# Altium project PUA.PrjPcb (part 1 of 14)
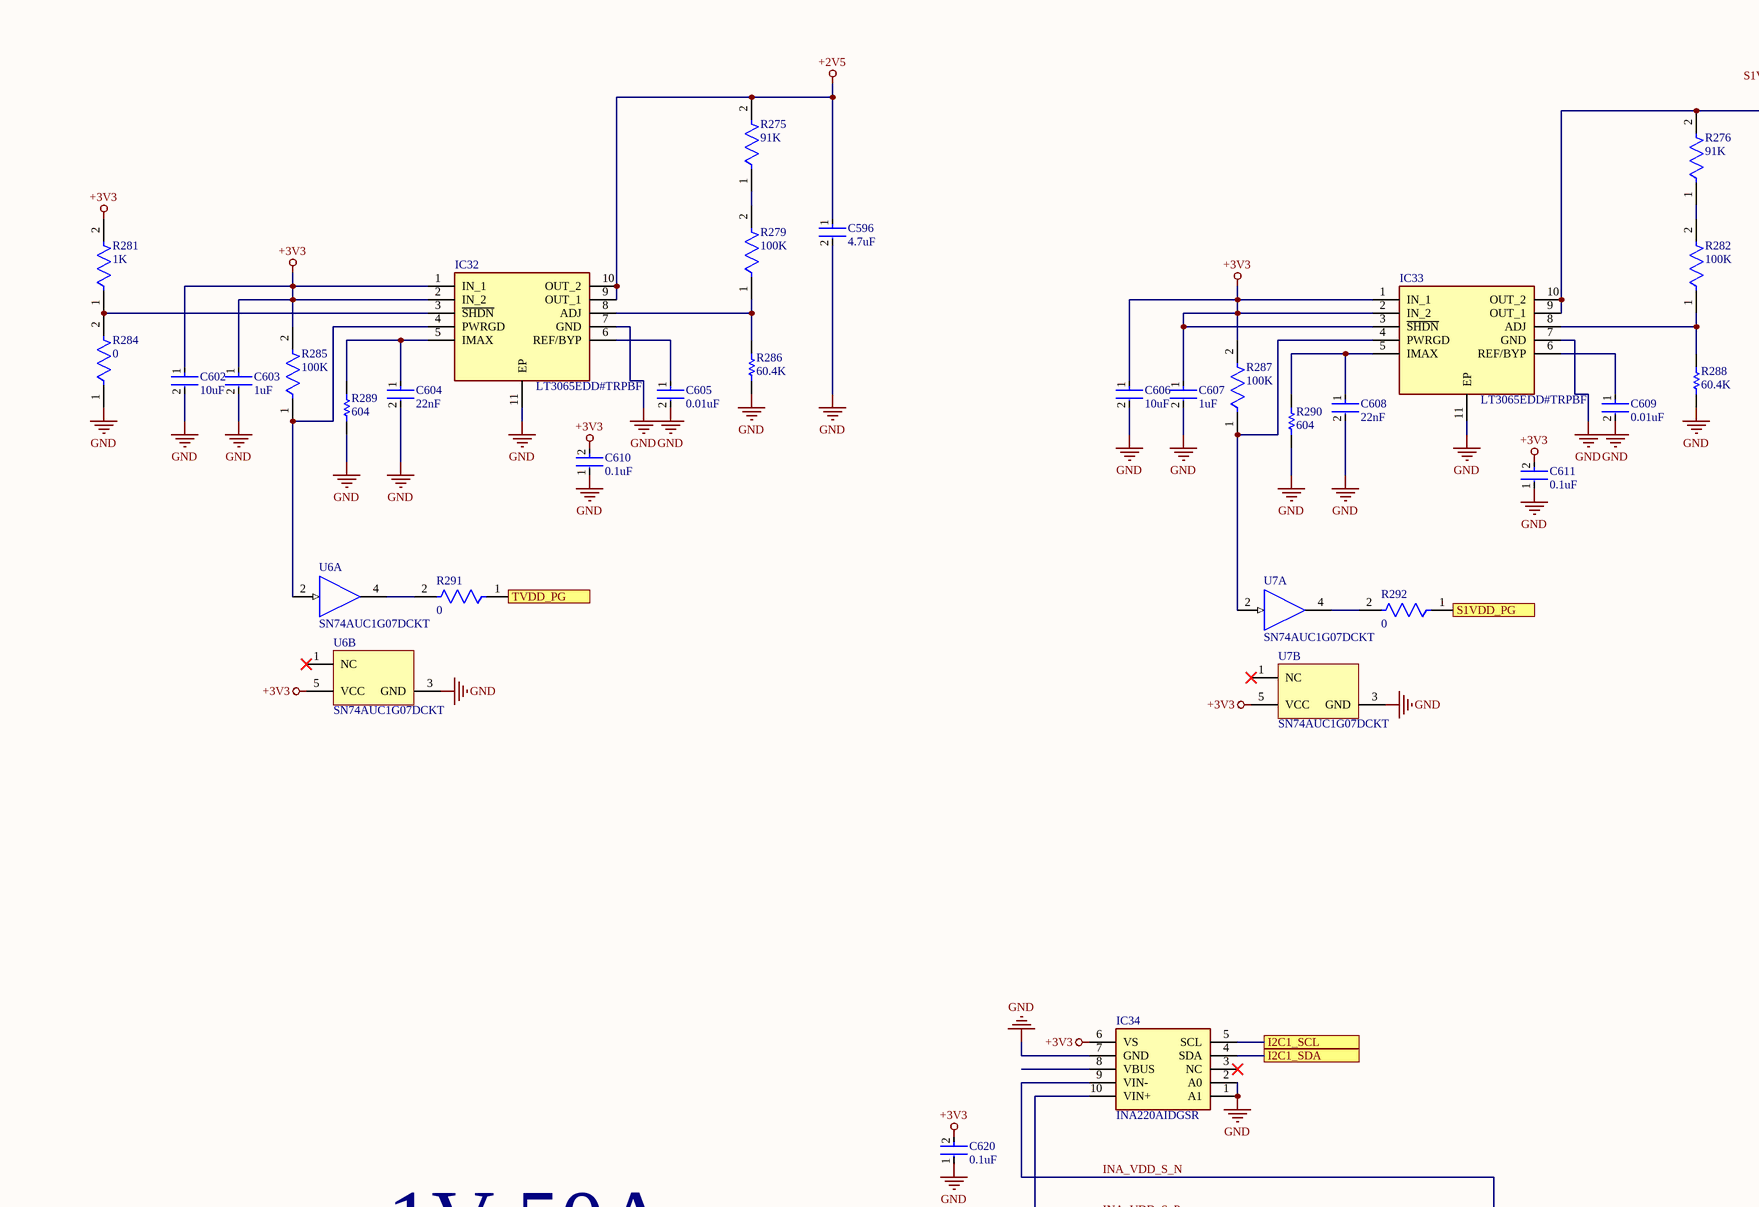
[diagram p0: Main_Power.SchDoc, top left]
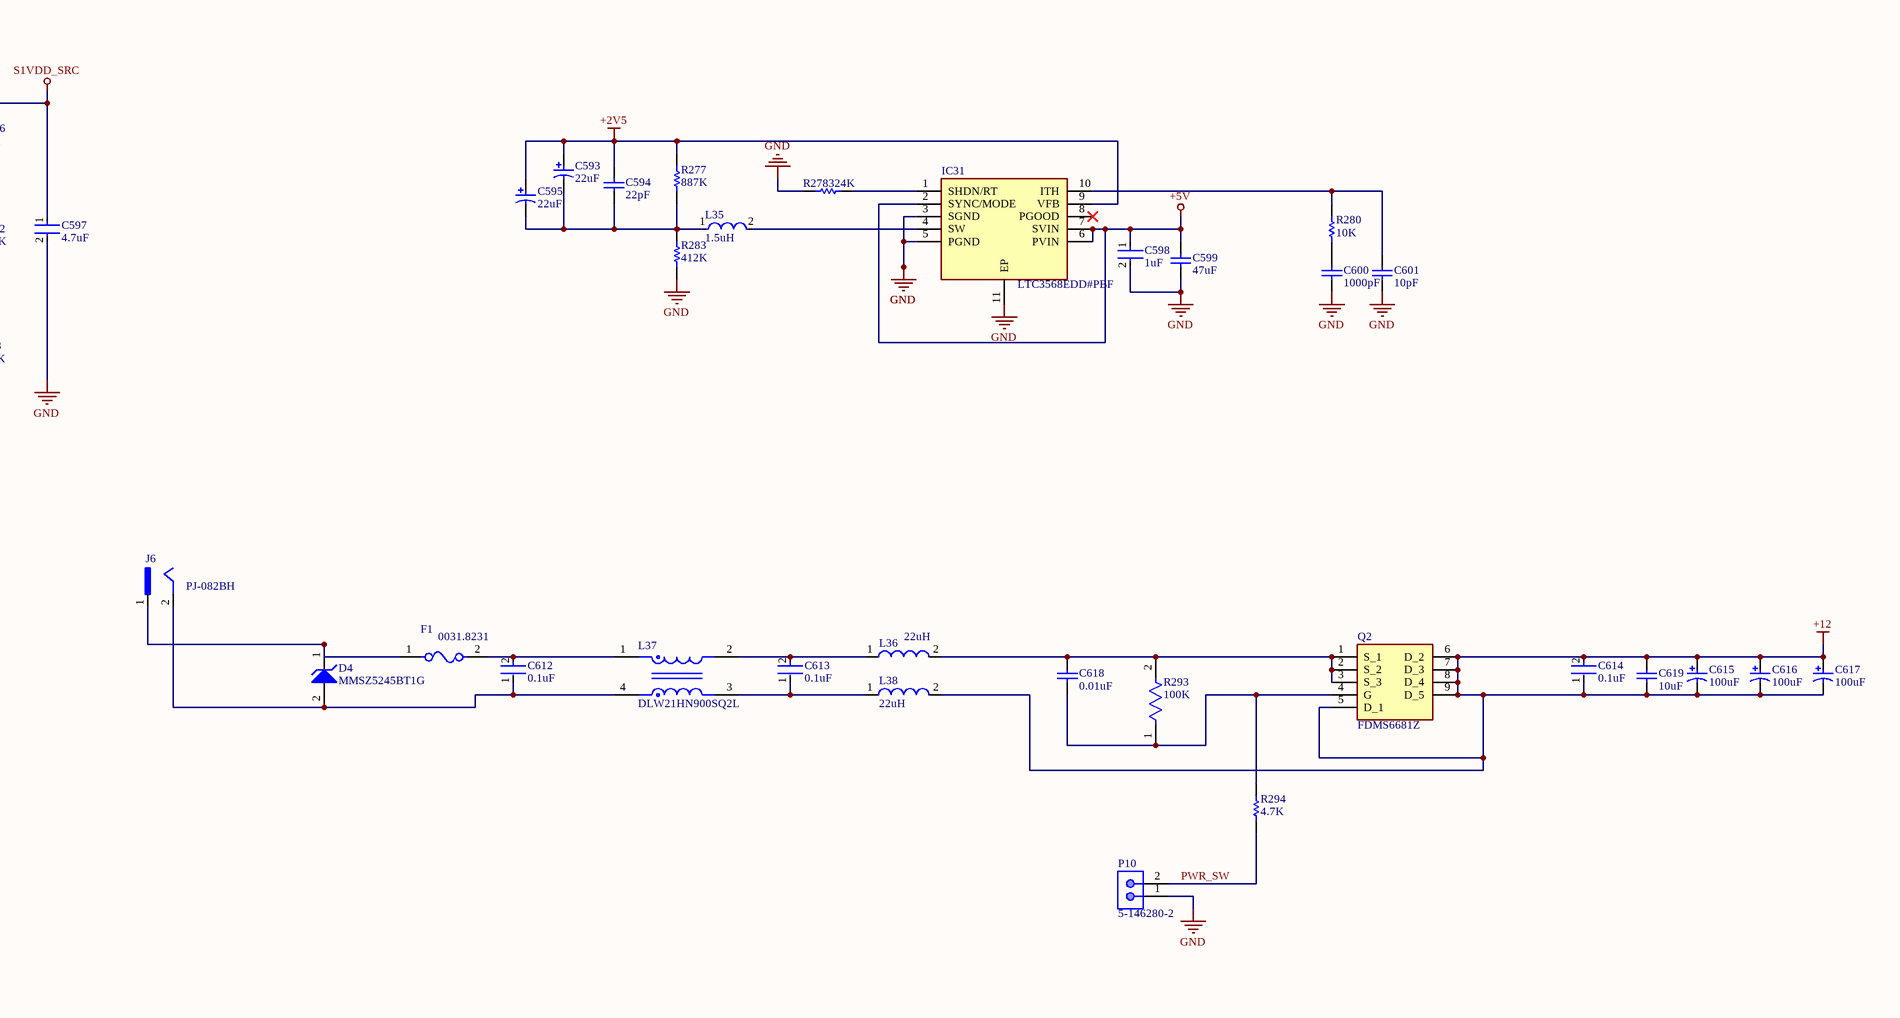
[diagram p1: Main_Power.SchDoc, top right]
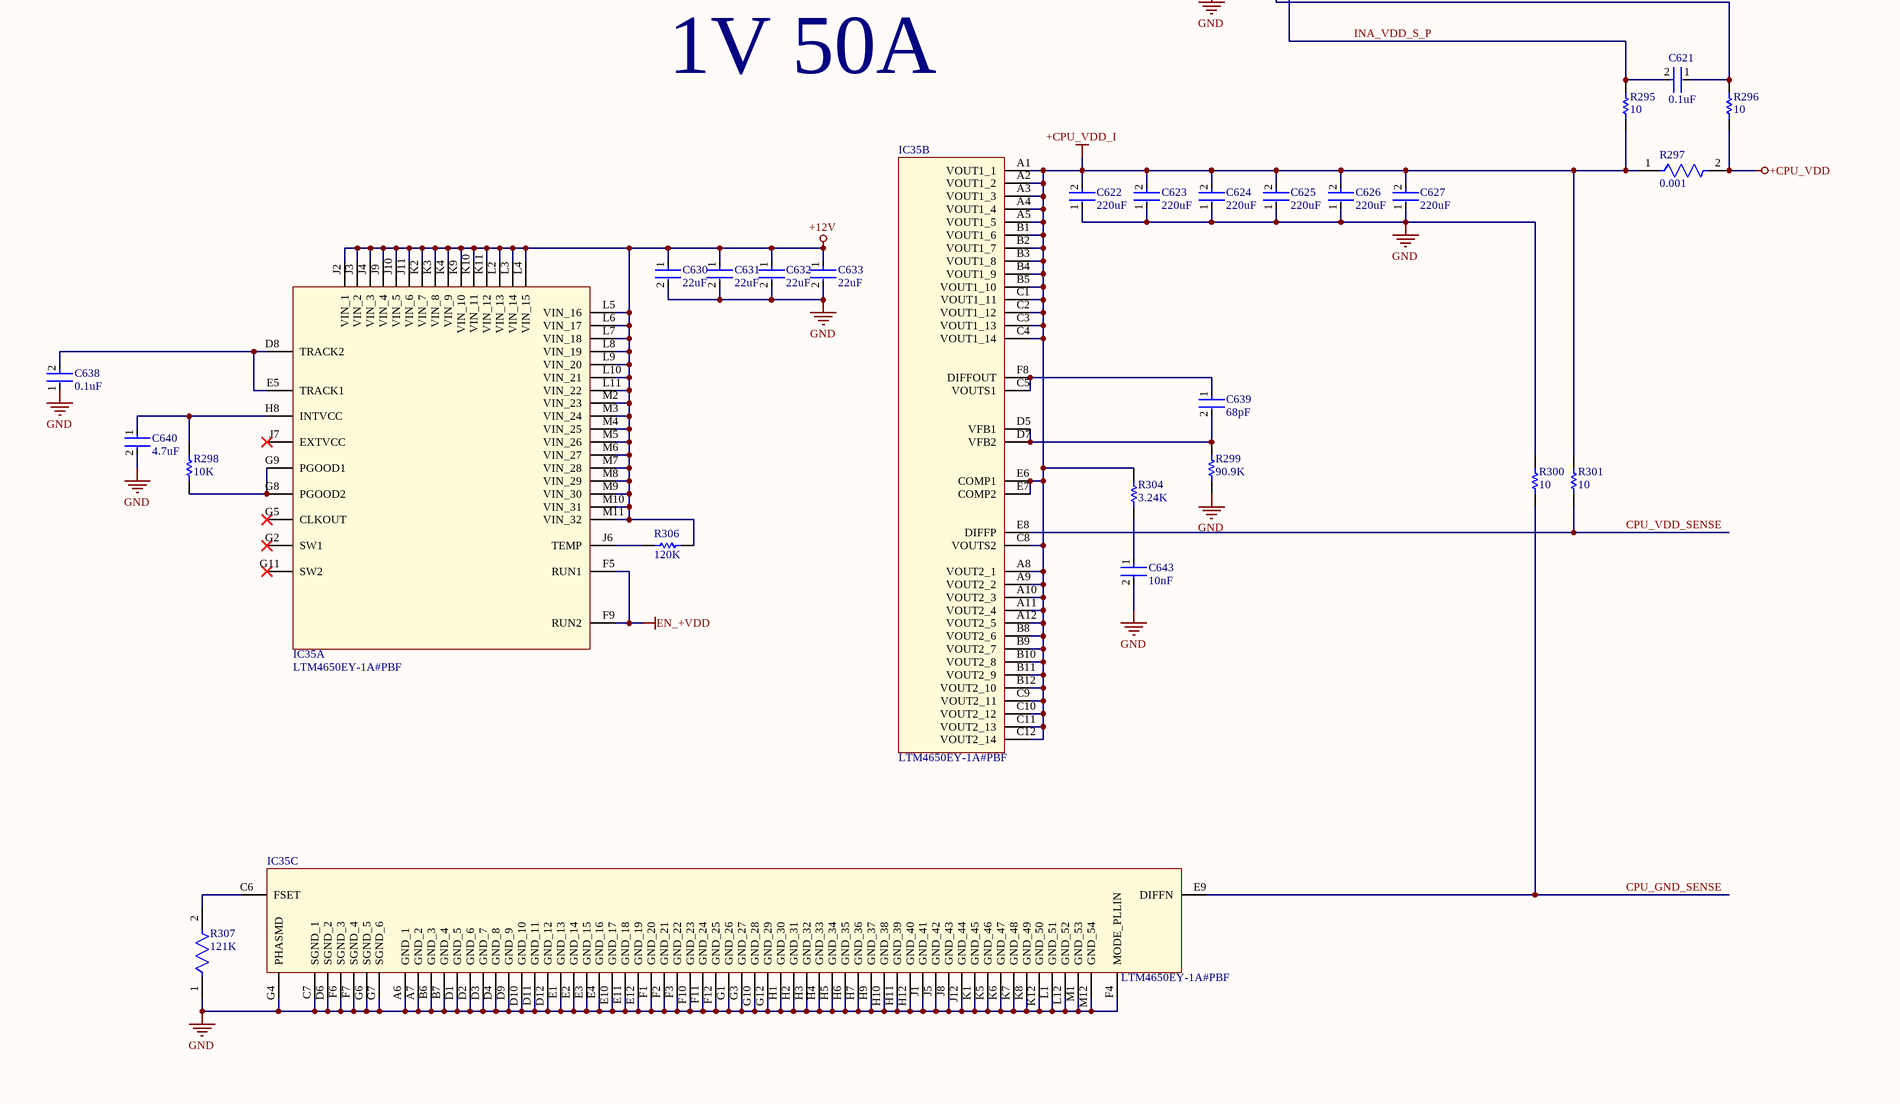
[diagram p2: Main_Power.SchDoc, bottom left]
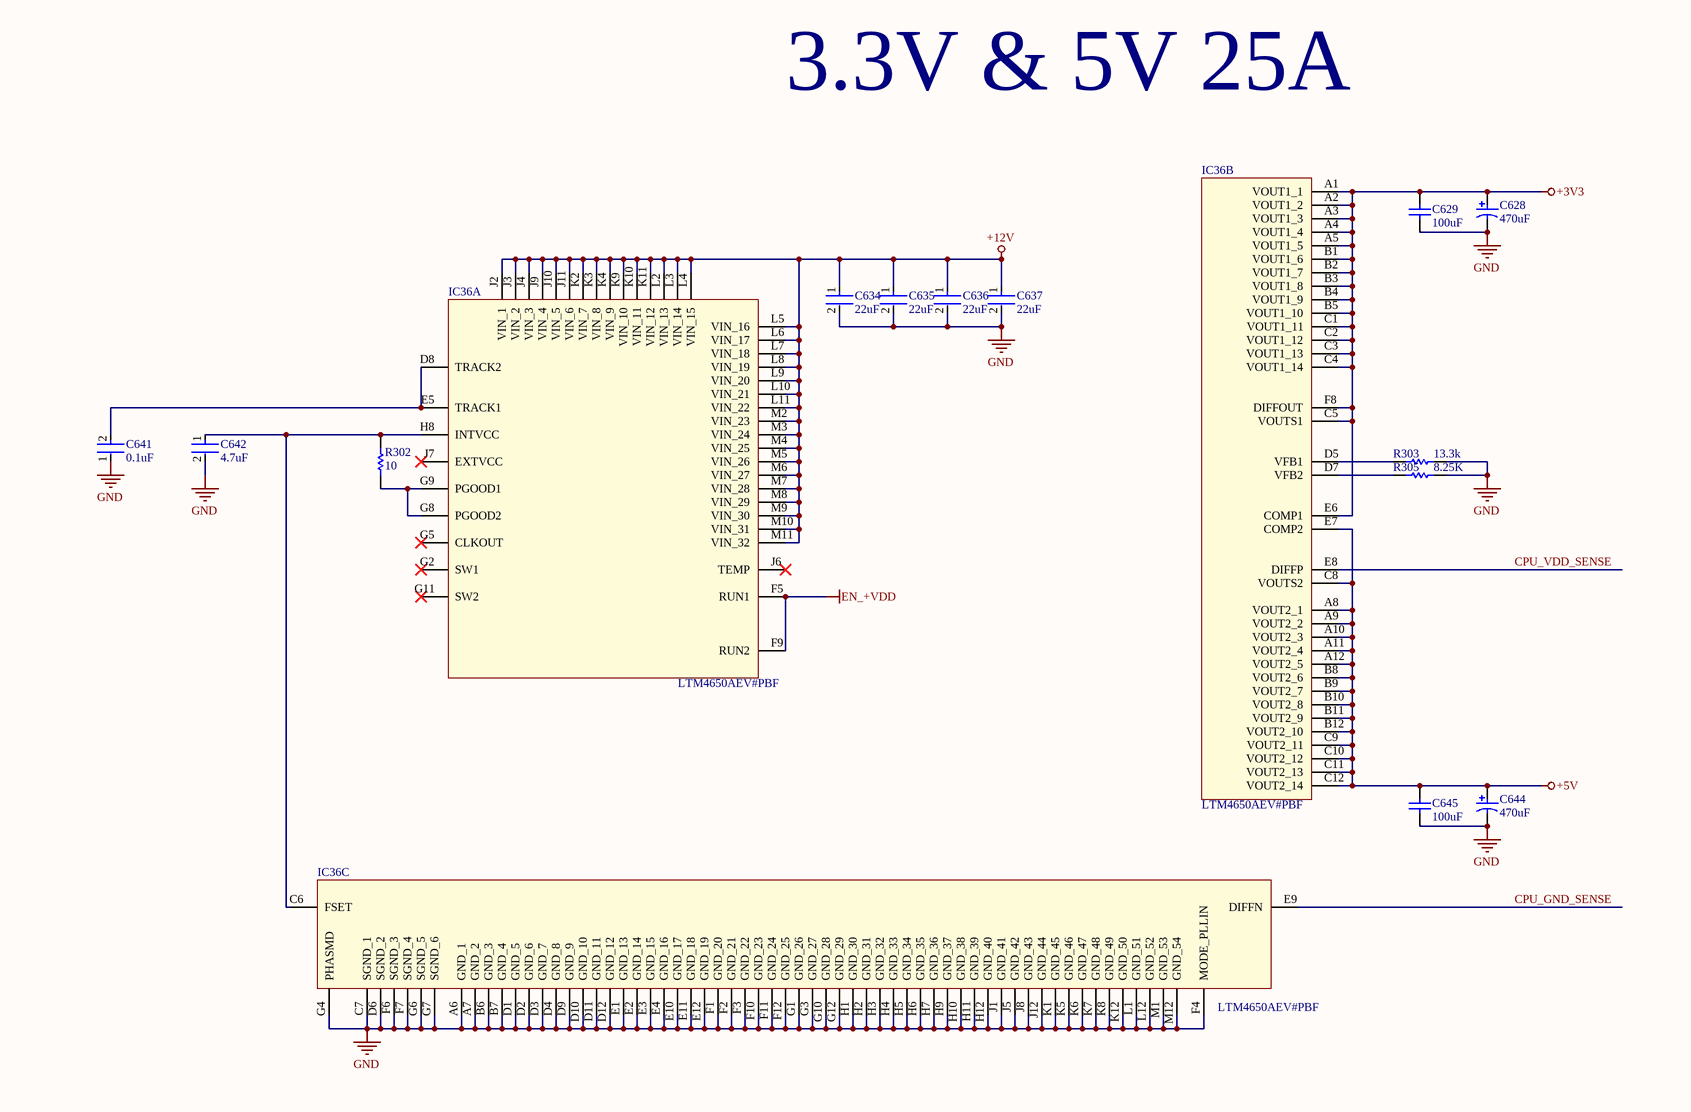
[diagram p3: Main_Power.SchDoc, bottom right]
28 sheets, 2246 parts. Net scope: hierarchical (ports join the sheet entries above them; power ports are global).
Sheets:
  Main_Power.SchDoc
  Public_CPU_Power.SchDoc
  Public_CPU_Reset_IO.SchDoc
  Public_CPU_IO.SchDoc
  Public_CPU_USB.SchDoc
  Public_CPU_DDR4.SchDoc
  Public_CPU_RGMII.SchDoc
  Public_CPU_Sub_Power_Supplies.SchDoc
  Public_QSGMII_ETHERNET.SchDoc
  Public_QSGMII_ETHERNET_POWER.SchDoc
  Private_CPU_Power.SchDoc
  Private_CPU_Reset_IO.SchDoc
  Private_CPU_IO.SchDoc
  Private_CPU_USB.SchDoc
  Private_CPU_DDR4.SchDoc
  Private_CPU_RGMII.SchDoc
  Private_CPU_Sub_Power_Supplies.SchDoc
  Server_CPU_Power.SchDoc
  Server_CPU_Reset_IO.SchDoc
  Server_CPU_IO.SchDoc
  Server_CPU_USB.SchDoc
  Server_CPU_DDR4.SchDoc
  Server_CPU_RGMII.SchDoc
  Server_CPU_Sub_Power_Supplies.SchDoc
  SGMII_CONNECTION.SchDoc
    U_Public_CPU_SerDes = Public_CPU_SerDes.SchDoc
    U_Private_CPU_SerDes = Private_CPU_SerDes.SchDoc
    U_Server_CPU_SerDes = Server_CPU_SerDes.SchDoc

## Sheet Main_Power.SchDoc
size D

### Parts
C593  22uF  [AVX-TAJ-B-2_M]
C594  22pF  [CAPC1005X55X25ML05T10]
C595  22uF  [AVX-TAJ-B-2_M]
C596  4.7uF  [FP-GRM155-0_1-IPC_B]
C597  4.7uF  [FP-GRM155-0_1-IPC_B]
C598  1uF  [FP-GRM15-0_1-MFG]
C599  47uF  [CAPC1206(3216)190_N]
C600  1000pF  [CAPC1005X55X25ML5T10]
C601  10pF  [CAPC1005X55X25ML05T10]
C602  10uF  [FP-C0805C-DG-MFG]
C603  1uF  [FP-GRM15-0_1-MFG]
C604  22nF  [FP-CL288-IPC_C]
C605  0.01uF  [FP-C0402-BB-MFG]
C606  10uF  [FP-C0805C-DG-MFG]
C607  1uF  [FP-GRM15-0_1-MFG]
C608  22nF  [FP-CL288-IPC_C]
C609  0.01uF  [FP-C0402-BB-MFG]
C610  0.1uF  [FP-GRM15-MFG]
C611  0.1uF  [FP-GRM15-MFG]
C612  0.1uF  [FP-GRM15-MFG]
C613  0.1uF  [FP-GRM15-MFG]
C614  0.1uF  [FP-GRM15-MFG]
C615  100uF  [PNSC-FK-V-D8_V]
C616  100uF  [PNSC-FK-V-D8_V]
C617  100uF  [PNSC-FK-V-D8_V]
C618  0.01uF  [CAPC1005X56X25LL10T15]
C619  10uF  [CAPC1210(3225)190_N]
C620  0.1uF  [FP-GRM15-MFG]
C621  0.1uF  [FP-GRM15-MFG]
C622  220uF  [FP-GRM31C-0_3-e0_3_0_9-IPC_C]
C623  220uF  [FP-GRM31C-0_3-e0_3_0_9-IPC_C]
C624  220uF  [FP-GRM31C-0_3-e0_3_0_9-IPC_C]
C625  220uF  [FP-GRM31C-0_3-e0_3_0_9-IPC_C]
C626  220uF  [FP-GRM31C-0_3-e0_3_0_9-IPC_C]
C627  220uF  [FP-GRM31C-0_3-e0_3_0_9-IPC_C]
C628  470uF  [KEMT-T495-X_L]
C629  100uF  [CAPC3225X280X50LL20T25]
C630  22uF  [FP-GRM32-MFG]
C631  22uF  [FP-GRM32-MFG]
C632  22uF  [FP-GRM32-MFG]
C633  22uF  [FP-GRM32-MFG]
C634  22uF  [FP-GRM32-MFG]
C635  22uF  [FP-GRM32-MFG]
C636  22uF  [FP-GRM32-MFG]
C637  22uF  [FP-GRM32-MFG]
C638  0.1uF  [FP-GRM15-MFG]
C639  68pF  [FP-C0805C-DN-MFG]
C640  4.7uF  [FP-GRM155-0_1-IPC_B]
C641  0.1uF  [FP-GRM15-MFG]
C642  4.7uF  [FP-GRM155-0_1-IPC_B]
C643  10nF  [FP-CC0603-DA-MFG]
C644  470uF  [KEMT-T495-X_L]
C645  100uF  [CAPC3225X280X50LL20T25]
D4  MMSZ5245BT1G  [ONSC-SOD-123-2-425-04_V]
F1  0031.8231  [FP-0031_8231-MFG]
IC31  LTC3568EDD#PBF  [SON50P300X300X80-11N-D]
IC32  LT3065EDD#TRPBF  [SON50P300X300X80-11N-D]
IC33  LT3065EDD#TRPBF  [SON50P300X300X80-11N-D]
IC34  INA220AIDGSR  [SOP50P490X110-10N]
IC35  LTM4650EY-1A#PBF  [BGA144C127P12X12_1600X1600X521]  (parts A,B,C of 3)
IC36  LTM4650AEV#PBF  [BGA144C127P12X12_1600X1600X521]  (parts A,B,C of 3)
J6  PJ-082BH  [CUI_PJ-082BH]
L35  1.5uH  [FP-IHLP-6767GZ-FP_3_825x1-MFG]
L36  22uH  [WE-HCI-1365]
L37  DLW21HN900SQ2L  [FP-DLW21HN-MFG]
L38  22uH  [WE-HCI-1365]
P10  5-146280-2  [TECO-5-146280-2_V]
Q2  FDMS6681Z  [FDMS6681Z]
R275  91K  [FP-CRCW0402-e3-IPC_B]
R276  91K  [FP-CRCW0402-e3-IPC_B]
R277  887K  [RESC1005X40X25ML05T05]
R278  324K  [RESC1005X40X25LL05T05]
R279  100K  [FP-CRCW0402-e3-IPC_C]
R280  10K  [RESC1005X40X25LL05T05]
R281  1K  [FP-CRCW0402-e3-MFG]
R282  100K  [FP-CRCW0402-e3-IPC_C]
R283  412K  [RESC1005X40X25LL05T05]
R284  0  [FP-CRCW0402-e3-IPC_C]
R285  100K  [FP-CRCW0402-e3-IPC_C]
R286  60.4K  [RESC1005X40X25NL05T05]
R287  100K  [FP-CRCW0402-e3-IPC_C]
R288  60.4K  [RESC1005X40X25NL05T05]
R289  604  [RESC1005X40X25ML05T05]
R290  604  [RESC1005X40X25ML05T05]
R291  0  [FP-CRCW0402-e3-IPC_C]
R292  0  [FP-CRCW0402-e3-IPC_C]
R293  100K  [FP-CRCW0805-e3-MFG]
R294  4.7K  [RESC1005X40X25LL05T05]
R295  10  [RESC1005X40X25LL05T05]
R296  10  [RESC1005X40X25LL05T05]
R297  0.001  [FP-HCS3920FT1L00-MFG]
R298  10K  [RESC1005X40X25LL05T05]
R299  90.9K  [RESC1005X40X25NL05T05]
R300  10  [RESC1005X40X25LL05T05]
R301  10  [RESC1005X40X25LL05T05]
R302  10  [RESC1005X40X25LL05T05]
R303  13.3k  [RESC1005X40X25ML05T05]
R304  3.24K  [RESC2013X70X40ML20T20]
R305  8.25K  [RESC1609X50X30NL10T20]
R306  120K  [RESC1005X40X25NL05T05]
R307  121K  [FP-CRCW0402-e3-MFG]
U6  SN74AUC1G07DCKT  [DCK0005A_M]  (parts A,B of 2)
U7  SN74AUC1G07DCKT  [DCK0005A_M]  (parts A,B of 2)

### Ports
I2C1_SCL, I2C1_SDA, S1VDD_PG, TVDD_PG

### Nets
+2V5: C593.1 C594.2 C595.1 C596.1 IC31.9(VFB) IC32.9(OUT_1) IC32.10(OUT_2) R275.2 R277.2
+3V3: C602.1 C603.1 C606.1 C607.1 C610.2 C611.2 C620.2 C628.1 C629.2 IC32.1(IN_1) IC32.2(IN_2) IC33.1(IN_1) IC33.2(IN_2) IC33.3(~{SHDN}) IC34.6(VS) IC36.A1(VOUT1_1) IC36.A2(VOUT1_2) IC36.A3(VOUT1_3) IC36.A4(VOUT1_4) IC36.A5(VOUT1_5) IC36.B1(VOUT1_6) IC36.B2(VOUT1_7) IC36.B3(VOUT1_8) IC36.B4(VOUT1_9) IC36.B5(VOUT1_10) IC36.C1(VOUT1_11) IC36.C2(VOUT1_12) IC36.C3(VOUT1_13) IC36.C4(VOUT1_14) IC36.C5(VOUTS1) IC36.E6(COMP1) IC36.F8(DIFFOUT) R281.2 R285.2 R287.2 U6.5(VCC) U7.5(VCC)
+5V: C598.1 C599.2 C644.1 C645.2 IC31.2(SYNC/MODE) IC31.6(PVIN) IC31.7(SVIN) IC36.A8(VOUT2_1) IC36.A9(VOUT2_2) IC36.A10(VOUT2_3) IC36.A11(VOUT2_4) IC36.A12(VOUT2_5) IC36.B8(VOUT2_6) IC36.B9(VOUT2_7) IC36.B10(VOUT2_8) IC36.B11(VOUT2_9) IC36.B12(VOUT2_10) IC36.C8(VOUTS2) IC36.C9(VOUT2_11) IC36.C10(VOUT2_12) IC36.C11(VOUT2_13) IC36.C12(VOUT2_14) IC36.E7(COMP2)
+12: C614.1 C614.2 C615.1 C615.2 C616.1 C616.2 C617.1 C617.2 C619.1 C619.2 L38.2 Q2.5(D_1) Q2.6(D_2) Q2.7(D_3) Q2.8(D_4) Q2.9(D_5)
+12V: C630.1 C631.1 C632.1 C633.1 C634.1 C635.1 C636.1 C637.1 IC35.J2(VIN_1) IC35.J3(VIN_2) IC35.J4(VIN_3) IC35.J9(VIN_4) IC35.J10(VIN_5) IC35.J11(VIN_6) IC35.K2(VIN_7) IC35.K3(VIN_8) IC35.K4(VIN_9) IC35.K9(VIN_10) IC35.K10(VIN_11) IC35.K11(VIN_12) IC35.L2(VIN_13) IC35.L3(VIN_14) IC35.L4(VIN_15) IC35.L5(VIN_16) IC35.L6(VIN_17) IC35.L7(VIN_18) IC35.L8(VIN_19) IC35.L9(VIN_20) IC35.L10(VIN_21) IC35.L11(VIN_22) IC35.M2(VIN_23) IC35.M3(VIN_24) IC35.M4(VIN_25) IC35.M5(VIN_26) IC35.M6(VIN_27) IC35.M7(VIN_28) IC35.M8(VIN_29) IC35.M9(VIN_30) IC35.M10(VIN_31) IC35.M11(VIN_32) IC36.J2(VIN_1) IC36.J3(VIN_2) IC36.J4(VIN_3) IC36.J9(VIN_4) IC36.J10(VIN_5) IC36.J11(VIN_6) IC36.K2(VIN_7) IC36.K3(VIN_8) IC36.K4(VIN_9) IC36.K9(VIN_10) IC36.K10(VIN_11) IC36.K11(VIN_12) IC36.L2(VIN_13) IC36.L3(VIN_14) IC36.L4(VIN_15) IC36.L5(VIN_16) IC36.L6(VIN_17) IC36.L7(VIN_18) IC36.L8(VIN_19) IC36.L9(VIN_20) IC36.L10(VIN_21) IC36.L11(VIN_22) IC36.M2(VIN_23) IC36.M3(VIN_24) IC36.M4(VIN_25) IC36.M5(VIN_26) IC36.M6(VIN_27) IC36.M7(VIN_28) IC36.M8(VIN_29) IC36.M9(VIN_30) IC36.M10(VIN_31) IC36.M11(VIN_32) R306.1
+CPU_VDD: R296.1 R297.2
+CPU_VDD_I: C622.2 C623.2 C624.2 C625.2 C626.2 C627.2 IC35.A1(VOUT1_1) IC35.A2(VOUT1_2) IC35.A3(VOUT1_3) IC35.A4(VOUT1_4) IC35.A5(VOUT1_5) IC35.A8(VOUT2_1) IC35.A9(VOUT2_2) IC35.A10(VOUT2_3) IC35.A11(VOUT2_4) IC35.A12(VOUT2_5) IC35.B1(VOUT1_6) IC35.B2(VOUT1_7) IC35.B3(VOUT1_8) IC35.B4(VOUT1_9) IC35.B5(VOUT1_10) IC35.B8(VOUT2_6) IC35.B9(VOUT2_7) IC35.B10(VOUT2_8) IC35.B11(VOUT2_9) IC35.B12(VOUT2_10) IC35.C1(VOUT1_11) IC35.C2(VOUT1_12) IC35.C3(VOUT1_13) IC35.C4(VOUT1_14) IC35.C8(VOUTS2) IC35.C9(VOUT2_11) IC35.C10(VOUT2_12) IC35.C11(VOUT2_13) IC35.C12(VOUT2_14) IC35.E6(COMP1) IC35.E7(COMP2) R295.1 R297.1 R301.2 R304.2
EN_+VDD: IC35.F5(RUN1) IC35.F9(RUN2) IC36.F5(RUN1) IC36.F9(RUN2)
GND: C596.2 C597.2 C598.2 C599.1 C600.1 C601.1 C602.2 C603.2 C604.2 C605.2 C606.2 C607.2 C608.2 C609.2 C610.1 C611.1 C620.1 C622.1 C623.1 C624.1 C625.1 C626.1 C627.1 C628.2 C629.1 C630.2 C631.2 C632.2 C633.2 C634.2 C635.2 C636.2 C637.2 C638.1 C640.2 C641.1 C642.2 C643.2 C644.2 C645.1 IC31.3(SGND) IC31.5(PGND) IC31.11(EP) IC32.7(GND) IC32.11(EP) IC33.7(GND) IC33.11(EP) IC34.1(A1) IC34.2(A0) IC34.7(GND) IC35.A6(GND_1) IC35.A7(GND_2) IC35.B6(GND_3) IC35.B7(GND_4) IC35.C7(SGND_1) IC35.D1(GND_5) IC35.D2(GND_6) IC35.D3(GND_7) IC35.D4(GND_8) IC35.D6(SGND_2) IC35.D9(GND_9) IC35.D10(GND_10) IC35.D11(GND_11) IC35.D12(GND_12) IC35.E1(GND_13) IC35.E2(GND_14) IC35.E3(GND_15) IC35.E4(GND_16) IC35.E10(GND_17) IC35.E11(GND_18) IC35.E12(GND_19) IC35.F1(GND_20) IC35.F2(GND_21) IC35.F3(GND_22) IC35.F4(MODE_PLLIN) IC35.F6(SGND_3) IC35.F7(SGND_4) IC35.F10(GND_23) IC35.F11(GND_24) IC35.F12(GND_25) IC35.G1(GND_26) IC35.G3(GND_27) IC35.G4(PHASMD) IC35.G6(SGND_5) IC35.G7(SGND_6) IC35.G10(GND_28) IC35.G12(GND_29) IC35.H1(GND_30) IC35.H2(GND_31) IC35.H3(GND_32) IC35.H4(GND_33) IC35.H5(GND_34) IC35.H6(GND_35) IC35.H7(GND_36) IC35.H9(GND_37) IC35.H10(GND_38) IC35.H11(GND_39) IC35.H12(GND_40) IC35.J1(GND_41) IC35.J5(GND_42) IC35.J8(GND_43) IC35.J12(GND_44) IC35.K1(GND_45) IC35.K5(GND_46) IC35.K6(GND_47) IC35.K7(GND_48) IC35.K8(GND_49) IC35.K12(GND_50) IC35.L1(GND_51) IC35.L12(GND_52) IC35.M1(GND_53) IC35.M12(GND_54) IC36.A6(GND_1) IC36.A7(GND_2) IC36.B6(GND_3) IC36.B7(GND_4) IC36.C7(SGND_1) IC36.D1(GND_5) IC36.D2(GND_6) IC36.D3(GND_7) IC36.D4(GND_8) IC36.D6(SGND_2) IC36.D9(GND_9) IC36.D10(GND_10) IC36.D11(GND_11) IC36.D12(GND_12) IC36.E1(GND_13) IC36.E2(GND_14) IC36.E3(GND_15) IC36.E4(GND_16) IC36.E10(GND_17) IC36.E11(GND_18) IC36.E12(GND_19) IC36.F1(GND_20) IC36.F2(GND_21) IC36.F3(GND_22) IC36.F4(MODE_PLLIN) IC36.F6(SGND_3) IC36.F7(SGND_4) IC36.F10(GND_23) IC36.F11(GND_24) IC36.F12(GND_25) IC36.G1(GND_26) IC36.G3(GND_27) IC36.G4(PHASMD) IC36.G6(SGND_5) IC36.G7(SGND_6) IC36.G10(GND_28) IC36.G12(GND_29) IC36.H1(GND_30) IC36.H2(GND_31) IC36.H3(GND_32) IC36.H4(GND_33) IC36.H5(GND_34) IC36.H6(GND_35) IC36.H7(GND_36) IC36.H9(GND_37) IC36.H10(GND_38) IC36.H11(GND_39) IC36.H12(GND_40) IC36.J1(GND_41) IC36.J5(GND_42) IC36.J8(GND_43) IC36.J12(GND_44) IC36.K1(GND_45) IC36.K5(GND_46) IC36.K6(GND_47) IC36.K7(GND_48) IC36.K8(GND_49) IC36.K12(GND_50) IC36.L1(GND_51) IC36.L12(GND_52) IC36.M1(GND_53) IC36.M12(GND_54) P10.1 R278.1 R283.1 R284.1 R286.1 R288.1 R289.1 R290.1 R299.1 R300.2 R303.2 R305.2 R307.1 U6.3(GND) U7.3(GND)
S1VDD_SRC: C597.1 IC33.9(OUT_1) IC33.10(OUT_2) R276.2
CPU_GND_SENSE: IC35.E9(DIFFN) IC36.E9(DIFFN) R300.1
CPU_VDD_SENSE: IC35.E8(DIFFP) IC36.E8(DIFFP) R301.1
INA_VDD_S_N: C621.1 IC34.9(VIN-) R296.2
INA_VDD_S_P: C621.2 IC34.10(VIN+) R295.2
PWR_SW: P10.2 R294.1
NetC593_2: C593.2 C594.1 C595.2 L35.1 R277.1 R283.2
NetC600_2: C600.2 R280.1
NetC601_2: C601.2 IC31.10(ITH) R280.2
NetC604_1: C604.1 IC32.5(IMAX) R289.2
NetC605_1: C605.1 IC32.6(REF/BYP)
NetC608_1: C608.1 IC33.5(IMAX) R290.2
NetC609_1: C609.1 IC33.6(REF/BYP)
NetC612_1: C612.1 D4.2(A) J6.2 L37.4
NetC612_2: C612.2 F1.2 L37.1
NetC613_1: C613.1 L37.3 L38.1
NetC613_2: C613.2 L36.1 L37.2
NetC618_1: C618.1 Q2.4(G) R293.1 R294.2
NetC618_2: C618.2 L36.2 Q2.1(S_1) Q2.2(S_2) Q2.3(S_3) R293.2
NetC638_2: C638.2 IC35.D8(TRACK2) IC35.E5(TRACK1)
NetC639_1: C639.1 IC35.C5(VOUTS1) IC35.F8(DIFFOUT)
NetC639_2: C639.2 IC35.D5(VFB1) IC35.D7(VFB2) R299.2
NetC640_1: C640.1 IC35.H8(INTVCC) R298.2
NetC641_2: C641.2 IC36.D8(TRACK2) IC36.E5(TRACK1)
NetC642_1: C642.1 IC36.C6(FSET) IC36.H8(INTVCC) R302.2
NetC643_1: C643.1 R304.1
NetD4_1: D4.1(K) F1.1 J6.1
NetIC31_1: IC31.1(SHDN/RT) R278.2
NetIC31_4: IC31.4(SW) L35.2
NetIC32_3: IC32.3(~{SHDN}) R281.1 R284.2
NetIC32_4: IC32.4(PWRGD) R285.1 U6.2(A)
NetIC32_8: IC32.8(ADJ) R279.1 R286.2
NetIC33_4: IC33.4(PWRGD) R287.1 U7.2(A)
NetIC33_8: IC33.8(ADJ) R282.1 R288.2
NetIC34_4: IC34.4(SDA) ; port I2C1_SDA
NetIC34_5: IC34.5(SCL) ; port I2C1_SCL
NetIC35_C6: IC35.C6(FSET) R307.2
NetIC35_G8: IC35.G8(PGOOD2) IC35.G9(PGOOD1) R298.1
NetIC35_J6: IC35.J6(TEMP) R306.2
NetIC36_D5: IC36.D5(VFB1) R303.1
NetIC36_D7: IC36.D7(VFB2) R305.1
NetIC36_G8: IC36.G8(PGOOD2) IC36.G9(PGOOD1) R302.1
NetR275_1: R275.1 R279.2
NetR276_1: R276.1 R282.2
NetR291_1: R291.1 ; port TVDD_PG
NetR291_2: R291.2 U6.4(Y)
NetR292_1: R292.1 ; port S1VDD_PG
NetR292_2: R292.2 U7.4(Y)

Not connected (* = marked no-connect by the designer): IC31 8(PGOOD)*; IC34 3(NC)* 8(VBUS); IC35 G2(SW1)* G5(CLKOUT)* G11(SW2)* J7(EXTVCC)*; IC36 G2(SW1)* G5(CLKOUT)* G11(SW2)* J6(TEMP)* J7(EXTVCC)*; U6 1(NC)*; U7 1(NC)*

### Notes on the sheet
- 1V 50A
- 3.3V & 5V 25A
- Title
- Size:
- Date:
- File:
- D
- Number:
- Time:
- Revision:
- Sheet
- of

### Library data of the parts
C593 C595 = CMP-2100-03689-1: Standard Tantalum, 22 uF, +/- 10%, 16 V, -55 to 125 degC, 2-Pin SMD (1210), RoHS, Tape and Reel; Manufacturer: AVX; Leakage Current: 3.5uA; Dissipation Factor: 6%; Voltage Rating (DC): 16V; ESR (Equivalent Series Resistance): 2.3Ohm; Polarity: Polar; Package Quantity: 1; Tolerance: 10%; Number of Pins: 2; Manufacturer URL: http://www.avx.com/; Height - Seated (Max): 0.083inch; Case Code (Imperial): 1210; Package Reference: TAJ-B-2; Height: 1.9mm; Depth: 2.8mm; Packaging: TapeandReel; Termination: SMD/SMT; Case/Package: 1210; Lead Free: LeadFree; Min Operating Temperature: -55degC; Capacitance: 22uF; RoHSCompliant: True; Dielectric Material: Tantalum; Case Code (Metric): 3528; Width: 2.8mm; Datasheet URL: http://datasheets.avx.com/TAJ.pdf; Radiation Hardening: No; Package Description: 2-Pin Surface Mount Device, Body 3.5 x 2.85 mm; Length: 3.5mm; Voltage Rating: 16V; Datasheet Version: 42401.0; Max Operating Temperature: 125degC; REACH SVHC: NoSVHC; Voltage: 16V
C594 = CMP-2008-04304-1: Part Number: GRM1555C1H220JZ01D; Manufacturer: Murata
C596 C597 C640 C642 = CMP-2008-04549-2: Chip Multilayer Ceramic Capacitors for General Purpose, 0402, 4.7uF, X5R, 15%, 20%, 6.3V; Height: 0.5mm; Weight: 0.000212oz; Length: 1mm; Case Code (Metric): 1005; Packaging: Tape and Reel; Termination: SMD/SMT; Dielectric: X5R; Depth: 0.5mm; Case Code (Imperial): 0402; Min Operating Temperature: -55°C; Case/Package: 0402; Voltage: 6.3V; Width: 0.02inch; Capacitance: 4.7uF; Lead Free: Lead Free; Thickness: 0.022inch; Contact Plating: Tin; REACH SVHC: No SVHC; Package Quantity: 10000; Tolerance: 20%; Voltage Rating (DC): 6.3V; Voltage Rating: 6.3V; Mount: Surface Mount; Max Operating Temperature: 85°C
C598 C603 C607 = CMP-2008-04556-2: CAP CER 1UF 10V X5R 0402; Manufacturer Part Number: GRM155R61A105KE15D; Manufacturer: Murata; Material: Ceramic; Tolerance: 10%; Temperature Coefficient: 15%; Octopart: https://octopart.com/grm155r61a105ke15d-murata-197442; Lead Free: Yes; ComponentLink2Description: Datasheet; Temperature: -55°C to +85°C; Temperature Range High: +85°C; Height: 0.55mm; Capacitance: 1uF; Ipc Land Pattern Name: CAPC10050X50; ComponentLink2URL: https://search.murata.co.jp/Ceramy/image/img/A01X/G101/ENG/GRM155R61A105KE15-01A.pdf; Temperature Range Low: -55°C; Device Class L2: Capacitors; Voltage Rating: 10V; RoHS: TRUE; Device Class L1: Passive Components; Device Class L3: Ceramic Capacitors; Temperature Characteristic: X5R; Mouser Description: 0402 1 uF 10 V ±10% Tolerance X5R Surface Mount Multilayer Ceramic Capacitor; Automotive: No; Package: GRM15-0.1; Digikey Description: CAP CER 1UF 10V X5R 0402; Value: 1uF; Category: Cap
C599 = CMP-1037-05002-1: CAP 47uF 10V ±20% 1206 (3216 Metric) Thickness 1.9mm SMD; Case-Metric: 3216; Case-EIA: 1206; Tolerance: Â±20%; Technology: SMT; Rated Voltage: 10 V; Value: 47uF; Max Thickness: 1.9 mm
C600 = CMP-1662-00017-1: Chip Capacitor, 1 nF, +/- 10%, 50 V, -55 to 125 degC, 0402 (1005 Metric), RoHS, Tape and Reel; Case\/Package: 0402; Type (Capacitors): X7R; Voltage Rating (DC): 50 V; Capacitance: 1 nF; Width: 0.5 mm; Pins: 2; REACH SVHC: No SVHC; Length: 1 mm; Height: 0.5 mm; PackageDescription: 2-Pin Surface Mount Device, Body 1 x 0.5 mm; DatasheetVersion: 07/2016; Mount: Surface Mount; ComponentLink2Description: Datasheet; Tolerance: 10%; ComponentLink2URL: http://psearch.en.murata.com/capacitor/product/GRM155R71H102KA01%23.pdf; ComponentLink1URL: http://www.murata.com/; Case Code (Metric): 1005; Package Quantity: 10000; Min Operating Temperature: -55 degC; Max Operating Temperature: 125 degC; Voltage Rating: 50 V; ComponentLink1Description: Manufacturer URL; Packaging: Tape and Reel; Radiation Hardening: No; RoHSCompliant: true; PackageReference: 0402; Mounting Technology: Surface Mount; Case Code (Imperial): 0402
C601 = CMP-2008-04246-1: Part Number: GRM1555C1H100JZ01D; Manufacturer: Murata
C602 C606 = CMP-2007-03243-2: CAP CER 10UF 10V X5R 0805; Manufacturer Part Number: C0805C106K8PACTU; Manufacturer: Kemet; 3DS Part Number: 220-00001; Tolerance: 10%; Temperature Coefficient: 15%; Material: Ceramic; Device Class L2: Capacitors; Device Class L1: Passive Components; ComponentLink2URL: https://content.kemet.com/datasheets/KEM_C1006_X5R_SMD.pdf; Height: 1.4mm; Lead Free: Yes; Digikey Description: CAP CER 10UF 10V X5R 0805; Octopart: https://octopart.com/c0805c106k8pactu-kemet-98697; Capacitance: 10uF; Value: 10uF; Temperature Range Low: -55°C; Temperature: -55°C to +85°C; Automotive: No; Mouser Description: CAP CER 10UF 10V X5R 0805; Ipc Land Pattern Name: CAPC200125X125; Temperature Range High: +85°C; Voltage: 10V; RoHS: TRUE; Device Class L3: Ceramic Capacitors; ComponentLink2Description: Datasheet; Voltage Rating: 10V; Package: C0805C-DG; Temperature Characteristic: X5R; Category: Cap
C604 C608 = CMP-13271-003253-1: Cap Ceramic 22nF 16V X7R ±10% SMD 0402 +125°C Paper T/R; Width: 0.02inch; Mount: Surface Mount; Radiation Hardening: No; Case Code (Imperial): 0402; Thickness: 0.022inch; Height: 0.5mm; Tolerance: 10%; Length: 1mm; Packaging: Tape and Reel; Contact Plating: Tin; Case/Package: 0402; Min Operating Temperature: -55°C; Voltage: 16V; Voltage Rating: 16V; Package Quantity: 1; Case Code (Metric): 1005; Depth: 0.5mm; Capacitance: 22nF; Max Operating Temperature: 125°C; Dielectric: X7R
C605 C609 = CMP-2008-03072-2: CAP CER 10000PF 16V X7R 0402; Manufacturer Part Number: C0402C103K4RACTU; Manufacturer: Kemet; Tolerance: 0.1; Material: Ceramic; Value: 10,000 pF; Temperature Coefficient: 15%; Package: C0402-BB; Height: 0.55mm; Temperature Range Low: -55°C; Lead Free: Yes; Mouser Description: Capacitor; Ceramic; Cap; .010uF; Tol 10%; SMT; Vol-Rtg 16V; X7R; Tape and Reel; RoHS: TRUE; Capacitance: 10,000 pF; Device Class L3: Ceramic Capacitors; Voltage Rating: 16 V; Automotive: No; Temperature: -55°C to +125°C; Digikey Description: CAP CER 10000PF 16V X7R 0402; Temperature Characteristic: X7R; Temperature Range High: +125°C; Category: Cap; Ipc Land Pattern Name: CAPC10050X50; ComponentLink2URL: https://content.kemet.com/datasheets/KEM_C1002_X7R_SMD.pdf; Octopart: https://octopart.com/c0402c103k4ractu-kemet-130896; ComponentLink2Description: Datasheet; Device Class L1: Passive Components; Device Class L2: Capacitors
C610-C614 C620 C621 C638 C641 = CMP-2100-03641-2: CAP CER 0.1UF 16V X7R 0402; Manufacturer Part Number: GRM155R71C104KA88D; Manufacturer: Murata; Standoff Height: 0mm; Tolerance: 10%; Voltage Rating: 16Vdc; Material: Ceramic; Capacitance: 0.10μF; Value: 0.10μF; RoHS: TRUE; Temperature Characteristic: X7R; Octopart: https://octopart.com/grm155r71c104ka88d-murata-196880; Digikey Description: CAP CER 0.1UF 16V X7R 0402; Device Class L3: Ceramic Capacitors; Height: 0.55mm; ComponentLink2Description: Datasheet; Temperature Range Low: -55°C; Ipc Land Pattern Name: CAPC10050X219; ComponentLink2URL: https://search.murata.co.jp/Ceramy/image/img/A01X/G101/ENG/GRM155R71H471KA01-01A.pdf; Device Class L1: Passive Components; Lead Free: yes; Category: Cap; Package: GRM15; Temperature: -55°C to +125°C; Device Class L2: Capacitors; Temperature Range High: +125°C; Mouser Description: 0402 0.1 uF 16V ±10 % Tolerance X7R SMT Multilayer Ceramic Capacitor
C615-C617 = CMP-2000-06206-1: Aluminum Electrolytic Capacitor, 100 uF, +/- 20%, 25 V, 2-Pin SMD (Size Code D8), -55 to 105 degC, RoHS, Tape and Reel; Manufacturer: Panasonic; Type: Can; Lifetime@Temperature: 2000Hrs@105°C; Capacitance: 100µF; Rated Voltage: 25V; Ripple Current: 280mA; Impedance: 0.34O; Case Size/Dimension: Ø6.3x7.7mm; Operating Temp-Max: 105°C; Series: FK; Package URL: http://industrial.panasonic.com/cdbs/www-data/pdf/RDE0000/DME0000COL48.pdf; Mounting Technology: SurfaceMount; Package Description: 2-Pin Electrolytic Aluminum Capacitor, Body 6.6 x 6.6 mm; Datasheet Version: 03/2016; Datasheet URL: http://industrial.panasonic.com/cdbs/www-data/pdf/RDE0000/ABA0000C1181.pdf; Manufacturer URL: http://www.panasonic.com/; Package Reference: FK-V-D8; Operating Temp Range: -55to+105°C
C618 = CMP-2008-02796-1: Manufacturer: AVX Interconnect / Elco; Part Number: 0402YC103JAT2A
C619 = CMP-1038-02223-1: CAP 10uF 16V -20% to +80% 1210 (3225 Metric) Thickness 1.9mm SMD; Case-EIA: 1210; Case-Metric: 3225; Rated Voltage: 16 V; Tolerance: -20% to +80%; Value: 10uF; Technology: SMT; Max Thickness: 1.9 mm
C622-C627 = CMP-06035-000079-2: Chip Multilayer Ceramic Capacitors for General Purpose, 1206, 220uF, X5R, 15%, 20%, 6.3V; Mount: Surface Mount; Width: 0.063inch; Voltage Rating: 6.3V; Packaging: Cut Tape; Dielectric: X5R; Capacitance: 220uF; Voltage Rating (DC): 6.3V; Case/Package: 1206; Thickness: 0.075inch; Tolerance: 20%; Max Operating Temperature: 85°C; Case Code (Metric): 3216; Min Operating Temperature: -55°C; Length: 0.126inch; REACH SVHC: No SVHC; Case Code (Imperial): 1206
C628 C644 = CMP-2000-07213-1: Tantalum Capacitor, 470 uF, +/- 10%, 10 V, -55 to 125 degC, 2-Pin SMD, RoHS, Tape and Reel; Manufacturer: Kemet; Mfr Case Code: XCase; ESR: 100mOhms; Ripple Current: 1285mA; Leakage Current: 47uA; Voltage Rating: 10V; Case Length: 7.3mm; Dissipation Factor DF: 10; Case Width: 4.3mm; Case Code - mm: 7343; Dimensions: 4.3mmWx7.3mmL; Case Code - in: 2917; Packaging: Reel; Capacitance: 470uF; Datasheet URL: http://capacitoredge.kemet.com/capedge2/DataSheet/Datasheet-T495X477K010ATE100.pdf?pn=T495X477K010ATE100; Package / Case: 2917(7343metric); Package Description: 2-Pin Surface Mount Device, Body 7.3 x4.3 mm; Mounting Technology: SurfaceMount; Manufacturer URL: http://www.kemet.com/; Tolerance: 10%; Factory Pack Quantity: 500; Product Category: TantalumCapacitors-SolidSMD; RoHS: Details; Height: 4.3mm; Product: TantalumSolidLowESRIndustrialGrade; Package Reference: T495-X; Series: T495; Operating Temperature Range: -55Cto+125C; Datasheet Version: 10/2016; Termination Style: SMD/SMT
C629 C645 = CMP-2000-06018-1: Chip Capacitor, 100 uF, +/- 20%, 6.3 V, -55 to 85 degC, 1210 (3225 Metric), RoHS, Tape and Reel; Manufacturer: KEMET; Dielectric: X5R; Product Height: 2.5mm; Product Length: 3.2mm; Voltage: 6.3Vdc; Manufacturer URL: http://www.kemet.com/; Category: CapacitorCeramicMultilayer; Package/Case: 1210; Operating Temperature: -55to85°C; Tolerance: 20%; Capacitance Value: 100uF; Package Description: 2-Pin Surface Mount Device, Body 3.2 x 2.5 mm; Datasheet Version: 11/2016; Mounting Technology: SurfaceMount; Construction: Flat; Package Reference: 1210; Mounting: SurfaceMount; Datasheet URL: http://www.kemet.com/docfinder?Partnumber=C1210C107M9PACTU
C630-C637 = CMP-2000-05458-2: CAP CER 22UF 25V X5R 1210; Manufacturer: Murata Electronics North America; Manufacturer Part Number: GRM32ER61E226KE15L; Possible Substitute: GRM32ER61E226KE15K; Other Names: 490-3889-2; Material: Ceramic; Tolerance: 10%; Digikey Description: CAP CER 22UF 25V X5R 1210; Mouser Description: Multilayer Ceramic Capacitors MLCC - SMD/SMT 1210 22uF 25volts X5R 10%; Device Class L2: Capacitors; Height: 2.7mm; Temperature Characteristic: X5R; Category: Cap; RoHS: TRUE; Operating Temperature: -55°C ~ 85°C; Temperature: -55°C to +85°C; Lead Free: Yes; Package: GRM32; Temperature Range High: +85°C; Package / Case: 1210 (3225 Metric); Standard Package: 1,000; Packaging: Cut Tape (CT); Capacitance: 22uF; Thickness (Max): 0.106" (2.70mm); Value: 22uF; Automotive: No; Device Class L1: Passive Components; Voltage - Rated: 25V; Temperature Range Low: -55°C; Size / Dimension: 0.126" L x 0.098" W (3.20mm x 2.50mm); ComponentLink2Description: Datasheet; Device Class L3: Ceramic Capacitors; Temperature Coefficient: X5R; ComponentLink2URL: https://search.murata.co.jp/Ceramy/image/img/A01X/G101/ENG/GRM32ER61E226KE15-01A.pdf; Voltage Rating: 25V; Octopart: https://octopart.com/grm32er61e226ke15l-murata-197441; Applications: General Purpose; Mounting Type: Surface Mount, MLCC
C639 = CMP-2007-00438-2: CAP CER 68PF 50V C0G/NP0 0805; Manufacturer Part Number: C0805C680J5GACTU; Manufacturer: KEMET; Temperature Coefficient: 30ppm/°C; Tolerance: 0.05; Temperature Characteristic: C0G; Material: Ceramic; ComponentLink2URL: https://content.kemet.com/datasheets/KEM_C1003_C0G_SMD.pdf; Device Class L1: Passive Components; Device Class L2: Capacitors; Capacitance: 68 pF; Value: 68 pF; Category: Cap; Octopart: https://octopart.com/c0805c680j5gactu-kemet-130145; Digikey Description: CAP CER 68PF 50V C0G/NP0 0805; Voltage Rating: 50 V; Ipc Land Pattern Name: CAPC200125X78; Lead Free: Yes; RoHS: TRUE; Device Class L3: Ceramic Capacitors; Mouser Description: Multilayer Ceramic Capacitors MLCC - SMD/SMT 50volts 68pF C0G 5%; Temperature Range High: +125°C; Temperature Range Low: -55°C; Height: 0.88mm; Temperature: -55°C to +125°C; ComponentLink2Description: Datasheet; Automotive: No; Package: C0805C-DN
C643 = CMP-2100-03600-2: CAP CER 10000PF 50V X7R 0603; Manufacturer Part Number: CC0603KRX7R9BB103; Manufacturer: YAGEO; Tolerance: 0.1; Material: Ceramic; Temperature Coefficient: 15%; Mouser Description: Multilayer Ceramic Capacitor, CC Series, 0.01 - F, - 10%, X7R, 50 V, 0603 [1608 Metric]; Digikey Description: CAP CER 10000PF 50V X7R 0603; Height: 0.9mm; Category: Cap; Temperature Characteristic: X7R; Footprint Url: http://www.yageo.com/exep/pages/download/literatures/UPY-C_GEN_24.pdf; Lead Free: Yes; Voltage Rating: 50 V; Temperature: -55°C to +125°C; Device Class L3: Ceramic Capacitors; ComponentLink2Description: Datasheet; Voltage: 50 V; Package: CC0603-DA; Octopart: https://octopart.com/cc0603krx7r9bb103-yageo-192938; Automotive: No; Temperature Range High: +125°C; Temperature Range Low: -55°C; Value: 10 nF; RoHS: TRUE; Device Class L1: Passive Components; ComponentLink2URL: http://www.yageo.com/documents/recent/UPY-GPHC_X7R_6.3V-to-50V_18.pdf; Device Class L2: Capacitors; Capacitance: 10 nF
D4 = CMP-1060-00535-1: Zener Voltage Regulator, 500 mW, 2-Pin SOD-123, Pb-Free, Tape and Reel; Manufacturer: On Semiconductor; P Max (W): 0.5; VZ Typ (V): 15; ComponentLink3URL: http://www.onsemi.com/pub_link/Collateral/425-04.PDF; Packing: Tape and Reel; DatasheetVersion: Rev. 12; ComponentLink2URL: http://www.onsemi.com/pub_link/Collateral/MMSZ5221BT1-D.PDF; Mounting Technology: Surface Mount; ComponentLink1Description: Manufacturer URL; ComponentLink1URL: http://www.onsemi.com/; ComponentLink2Description: Datasheet; PackageVersion: Rev. G, 10/2009; PackageReference: SOD-123-2-425-04; PackageDescription: 2-Pin SOD, Body 1.6 x 2.69 mm; ComponentLink3Description: Package Specification; RoHS: Pb-Free; PartNumber: MMSZ5245BT1G
F1 = CMP-26292-000005-1: FUSE BLOK CARTRIDGE 600V 16A PCB; Manufacturer: Schurter; Voltage Rating Ac: 500V; Number Of Fuses: 1; Standoff Height: 0.7mm; Conn Orientation: Horizontal; ComponentLink2URL: https://www.schurter.com/en/datasheet/typ_OGD.pdf; Voltage Rating Dc: 600V; Package: 0; Device Class L3: unset; Digikey Description: FUSE BLOK CARTRIDGE 600V 16A PCB; Mouser Description: Fuse Holder OGD FUSEHOLDER 5X20/6.3X32; Category: Fuse; Device Class L2: Fuse Holders; Height: 12.7mm; ComponentLink2Description: Datasheet; Ambient Temperature Range Low: -40°C; Ambient Temperature Range High: +85°C; Octopart: https://octopart.com/0031.8231-schurter-8659; Automotive: No; RoHS: TRUE; Fuse Current: 16A; Lead Free: Yes; Device Class L1: Circuit Protection; Manufacturer Part Number: 0031.8231
IC31 = LTC3568EDD#PBF: Integrated Circuit; Manufacturer_Name: Linear Technology; Datasheet Link: https://www.analog.com/media/en/technical-documentation/data-sheets/3568fa.pdf; Height: 0.8mm; Manufacturer_Part_Number: LTC3568EDD#PBF
IC32 IC33 = LT3065EDD#TRPBF: Integrated Circuit; Manufacturer_Name: Analog Devices; Datasheet Link: http://www.linear.com/docs/44316; Height: 0.8mm; Manufacturer_Part_Number: LT3065EDD#TRPBF; Mouser Part Number: 584-LT3065EDD#TRPBF; Mouser Price/Stock: https://www.mouser.co.uk/ProductDetail/Analog-Devices/LT3065EDDTRPBF?qs=hVkxg5c3xu9LuvC3J9QFFQ%3D%3D; Arrow Part Number: LT3065EDD#TRPBF; Arrow Price/Stock: https://www.arrow.com/en/products/lt3065eddtrpbf/analog-devices
IC34 = INA220AIDGSR: Integrated Circuit; Manufacturer_Name: Texas Instruments; Datasheet Link: http://componentsearchengine.com/Datasheets/1/INA220AIDGSR.pdf; Height: 1.1mm; Manufacturer_Part_Number: INA220AIDGSR; Mouser Part Number: 595-INA220AIDGSR; Mouser Price/Stock: https://www.mouser.co.uk/ProductDetail/Texas-Instruments/INA220AIDGSR?qs=nM5Sj1EaAzl3Pm1h3QWkPA%3D%3D; Arrow Part Number: INA220AIDGSR; Arrow Price/Stock: https://www.arrow.com/en/products/ina220aidgsr/texas-instruments
IC35 = LTM4650EY-1A#PBF: Integrated Circuit; Manufacturer_Name: Linear Technology; Datasheet Link: https://www.analog.com/media/en/technical-documentation/data-sheets/46501fc.pdf; Height: 5.21mm; Manufacturer_Part_Number: LTM4650EY-1A#PBF; Mouser Part Number: 584-LTM4650EY-1A#PBF; Mouser Price/Stock: https://www.mouser.co.uk/ProductDetail/Analog-Devices-Linear-Technology/LTM4650EY-1APBF?qs=oahfZPh6IAKwZ6TGDh4XYg%3D%3D
IC36 = LTM4650AEV#PBF: Integrated Circuit; Manufacturer_Name: Linear Technology; Datasheet Link: https://www.analog.com/media/en/technical-documentation/data-sheets/4650afb.pdf; Height: 5.21mm; Manufacturer_Part_Number: LTM4650AEV#PBF
J6 = PJ-082BH: 2.5 mm Center Pin, 10 A, Right Angle, Through Hole, Shielded, Dc Power Jack Connector; MF: {'manufacturer': u'CUI Devices'}; Value: *; Availability: Unavailable; Price: None; MP: PJ-082BH; Package: None
L35 = CMP-02424-000013-2: Commercial Inductors, Low DCR Series 1.5uH 48A 1.62mΩ 20%; Test Frequency: 100kHz; DC Resistance (DCR): 1.62mR; Max DC Current: 31A; Shielding: Shielded; Core Material: Metal; Self Resonant Frequency: 26MHz; Inductance: 1.5uH; Tolerance: 20%; Current Rating: 48A; Depth: 17.15mm; Lead Free: Lead Free; Min Operating Temperature: -55°C; Military Standard: Not; Max Operating Temperature: 125°C; Width: 0.675inch; Inductance Tolerance: 20%; Radiation Hardening: No; Number of Pins: 2; Package Quantity: 1; Height - Seated (Max): 0.276inch; Case/Package: 6767; RMS Current (Irms): 48A; Saturation Current: 31A; Termination: SMD/SMT; Height: 7mm; Length: 17.15mm; Packaging: Tape and Reel; Mount: Surface Mount
L36 L38 = CMP-0226-00043-1: SMD Flat Wire High Current Inductor WE-HCI, L=22.0 µH; Inductance: 22.0 ÂµH; ComponentLink1URL: http://www.we-online.com; ComponentLink2Description: Datasheet; PackageVersion: 2008; PackageReference: WE-HCI-1365; DatasheetVersion: ver 1, Aug-2009; PackageDescription: Inductor, 2-Leads, Body 13.2 x 12.8 mm; ComponentLink1Description: Manufacturer Link; ComponentLink2URL: http://www.we-online.de/katalog/media/pdf/7443551221.pdf
L37 = CMP-06045-000050-1: CMC 330MA 2LN 90 OHM SMD; Tolerance: 25%; Frequency: 100MHz; Shielding: Unshielded; Impedance: 90R; Number of Lines: 2; DC Resistance (DCR): 350mR; Voltage Rating: 50V; DC Current: 330mA; Current Rating: 330mA; Lead Free: Lead Free; Length: 2mm; Radiation Hardening: No; Max Operating Temperature: 85°C; Depth: 1.2mm; Weight: 0.000317oz; Height: 0.9mm; Termination: SMD/SMT; Min Operating Temperature: -40°C; Case/Package: 0805; Packaging: Tape and Reel; Width: 0.047inch; Test Frequency: 100MHz; Mount: Surface Mount; Current: 330mA; Military Standard: Not; Package Quantity: 1; Resistor Type: Wirewound; Case Code (Imperial): 0805; Max DC Current: 330mA
P10 = CMP-2000-07492-1: Male Header, Pitch 2.54 mm, 1 x 2 Position, Height 8.21 mm, Tail Length 3.05 mm, -65 to 105 degC, RoHS, Bulk; Manufacturer: TE Connectivity; Mating Connector Lock: No(Without); Number of Positions: 2; Pitch: 2.54mm; PCB Mounting Orientation: Vertical; Keyed: No; Case\/Package: 100; Mating Post Length: 0.23inch; High Temperature Housing: Yes; Max Current Rating: 5A; PCB Thickness: 0.063inch; PCB Mount Retention: Without; Approvals: CSA; Current Rating: 3A; Radiation Hardening: No; Length: 4.67mm; Contact Mating Length: 0.23inch; Connector Type: Header; Number of Rows: 1; Termination Post Length: 0.12inch; Board Standoff: No(Without); Max Operating Temperature: 105degC; Contact Shape: Square; Selectively Loaded: No(Without); Gasket: No(Without); Number of Contacts: 2; Contact Gender: Male; Mating Alignment: No(Without); Manufacturer URL: http://www.te.com/; Datasheet URL: http://www.te.com/commerce/DocumentDelivery/DDEController?Action=showdoc&DocId=Customer+Drawing%7F146280%7FH1%7Fpdf%7FEnglish%7FENG_CD_146280_H1.pdf%7F5-146280-2; Mount: ThroughHole; Orientation: Straight; Packaging: Carton; Package Reference: 5-146280-2; Package Quantity: 500; Stabilizers: No(Without); Row Spacing: 2.54mm; Contact Material: CopperAlloy; Panel Mount Retention: No(Without); Datasheet Version: Rev. H1, 08/2016; Housing Colour: Black; Colour: Black; Package Description: Male Header, Pitch 2.54 mm, 1 x 2 Position, Height 8.21 mm, Tail Length 3.05 mm; Contact Plating: Matte; Housing Material: Polymer; Contact Protection: No(Without); Min Operating Temperature: -65degC; Mounting Technology: ThroughHole; Flammability Rating: UL94V-0; RoHSCompliant: true; Termination: ThroughHole; Depth: 2.34mm; High Speed Serial Data Connector: No
Q2 = FDMS6681Z: MOSFET (P-Channel); Manufacturer_Name: ON Semiconductor; Datasheet Link: https://www.onsemi.com/pub/Collateral/FDMS6681Z-D.PDF; Height: 1.1mm; Manufacturer_Part_Number: FDMS6681Z; Mouser Part Number: 512-FDMS6681Z; Mouser Price/Stock: https://www.mouser.co.uk/ProductDetail/ON-Semiconductor-Fairchild/FDMS6681Z/?qs=eQsPqqG3NqYIemB4oC6BVw%3D%3D; Arrow Part Number: FDMS6681Z; Arrow Price/Stock: https://www.arrow.com/en/products/fdms6681z/on-semiconductor
R275 R276 = CMP-2002-00270-2: RES Thick Film, 91kΩ, 1%, 0.063W, 100ppm/°C, 0402; Power Rating: 63mW; Voltage Rating: 50V; Resistance: 91kR; Packaging: Tape and Reel; Max Operating Temperature: 155°C; Height: 0.35mm; Radiation Hardening: No; Tolerance: 1%; Number of Terminations: 2; Width: 0.02inch; Length: 1mm; Temperature Coefficient: 100ppm/°C; Features: Automotive AEC-Q200; Voltage Rating (DC): 50V; Weight: 2.3E-05oz; Min Operating Temperature: -55°C; Military Standard: Not; Max Power Dissipation: 63mW; Number of Pins: 2; Composition: Thick Film; Lead Free: Lead Free; Contact Plating: Tin; Case/Package: 0402; Termination: SMD/SMT; Package Quantity: 10; Case Code (Metric): 1005; Case Code (Imperial): 0402; Depth: 0.5mm
R277 = CMP-2002-00249-1: Part Number: CRCW0402887KFKED; Manufacturer: Vishay Dale
R278 = CMP-1665-00029-2: Chip Resistor, 324 KOhm, +/- 1%, 0.1 W, -55 to 155 degC, 0402 (1005 Metric), RoHS, Tape and Reel; PartNumber: ERJ-2RKF3243X; DatasheetVersion: 04/2015; Mounting Technology: Surface Mount; Resistance: 324 KOhm; ComponentLink2URL: http://industrial.panasonic.com/cdbs/www-data/pdf/RDA0000/AOA0000C86.pdf; PackageDescription: 2-Pin Surface Mount Device, Body 1 x 0.5 mm; Length: 1 mm; REACH SVHC: Yes; Case Code (Metric): 1005; Case/Package: 0402; ComponentLink2Description: Datasheet; Height: 0.35 mm; RoHSCompliant: True; Max Operating Temperature: 155 degC; Packaging: Tape and Reel; Case Code (Imperial): 0402; Tolerance: 1%; ComponentLink1URL: http://www.panasonic.com/; Min Operating Temperature: -55 degC; Width: 0.5 mm; Package Quantity: 10000; ComponentLink1Description: Manufacturer URL
R279 R282 R285 R287 = CMP-2002-08123-3: RES Thick Film, 100kΩ, 1%, 0.063W, 100ppm/°C, 0402; Power Rating: 63mW; Resistance: 100kR; Voltage Rating (DC): 50V; Lead Free: Lead Free; Height: 0.35mm; Contact Plating: Tin; Min Operating Temperature: -55°C; Package Quantity: 10000; Case/Package: 0402; Temperature Coefficient: 100ppm/°C; Number of Terminations: 2; Packaging: Tape and Reel; Max Power Dissipation: 63mW; Case Code (Metric): 1005; Mount: Surface Mount; Width: 0.02inch; Termination: SMD/SMT; Length: 1mm; Number of Pins: 2; Weight: 2.3E-05oz; Radiation Hardening: No; Tolerance: 1%; Military Standard: Not; Features: Automotive AEC-Q200; Depth: 0.5mm; Composition: Thick Film; Max Operating Temperature: 155°C; Voltage Rating: 50V; Case Code (Imperial): 0402
R280 R298 = CMP-2000-07588-1: Chip Resistor, 10 KOhm, +/- 1%, 0.1 W, -55 to 155 degC, 0402 (1005 Metric), RoHS, Tape and Reel; Manufacturer: Panasonic; Power Rating: 100mW; Voltage Rating: 50V; Resistance: 10KOhm; Case\/Package: 0402; Temperature Coefficient: 100ppm\/degreesC; RoHSCompliant: True; Lead Free: LeadFree; Package Quantity: 1; Contact Plating: Tin; Length: 1mm; Radiation Hardening: No; REACH SVHC: NoSVHC; Max Operating Temperature: 155degC; Depth: 0.5mm; Case Code (Imperial): 0402; Military Standard: Not; Package Description: 2-Pin Surface Mount Device, Body 1 x 0.5 mm; Termination: SMD/SMT; Case Code (Metric): 1005; Height: 0.35mm; Packaging: TapeandReel; Voltage Rating (DC): 50V; Package Reference: 402; Number of Pins: 2; Tolerance: 1%; Mounting Technology: SurfaceMount; Width: 0.02inch; Mount: SurfaceMount; Datasheet URL: https://industrial.panasonic.com/cdbs/www-data/pdf/RDA0000/AOA0000C304.pdf; Composition: ThickFilm; Datasheet Version: 02/2017; Manufacturer URL: http://www.panasonic.com/; Max Power Dissipation: 100mW; Number of Terminations: 2; Min Operating Temperature: -55degC
R281 = CMP-2002-08276-2: RES Thick Film, 1kΩ, 1%, 0.063W, 100ppm/°C, 0402; Resistance: 1kR; Power Rating: 63mW; Voltage Rating (DC): 50V; Package Quantity: 10; Termination: SMD/SMT; Width: 0.5mm; Military Standard: Not; Length: 1mm; Contact Plating: Tin; Mount: Surface Mount; Packaging: Tape and Reel; Case Code (Imperial): 0402; Tolerance: 1%; Weight: 2.3E-05oz; Number of Pins: 2; Case/Package: 0402; Case Code (Metric): 1005; Lead Free: Lead Free; Number of Terminations: 2; Max Power Dissipation: 63mW; Depth: 0.5mm; Temperature Coefficient: 100ppm/°C; Max Operating Temperature: 155°C; Height: 0.35mm; Features: Automotive AEC-Q200; Composition: Thick Film; Radiation Hardening: No; Voltage Rating: 50V; Min Operating Temperature: -55°C
R283 = CMP-2002-08619-1: Manufacturer: Vishay Dale; Part Number: CRCW0402412KFKED
R284 R291 R292 = CMP-2002-08122-2: RES Thick Film, 0Ω, 0.063W, 0402; Tolerance: 5%; Max Power Dissipation: 63mW; Voltage Rating: 50V; Temperature Coefficient: 100ppm/°C; Resistance: 0mR; Contact Plating: Tin; Height: 0.35mm; Radiation Hardening: No; Features: Automotive AEC-Q200; Composition: Thick Film; Width: 0.5mm; Weight: 2.3E-05oz; Termination: SMD/SMT; Packaging: Tape and Reel; Mount: Surface Mount; Case Code (Metric): 1005; Military Standard: Not; Min Operating Temperature: -55°C; Number of Terminations: 2; Package Quantity: 1; Case Code (Imperial): 0402; Depth: 0.5mm; Max Operating Temperature: 155°C; Case/Package: 0402; Power Rating: 63mW; Lead Free: Lead Free; Voltage Rating (DC): 50V; Length: 1mm
R286 R288 = CMP-2002-00139-1: Part Number: CRCW040260K4FKED; Manufacturer: Vishay Dale
R289 R290 = CMP-2002-01009-1: Part Number: ERJ-2RKF6040X; Manufacturer: Panasonic
R293 = CMP-2001-04899-2: RES Thick Film, 100kΩ, 1%, 0.125W, 100ppm/°C, 0805; Resistance: 100kR; Power Rating: 125mW; Voltage Rating: 150V; Case/Package: 0805; Max Operating Temperature: 155°C; Case Code (Imperial): 0805; Lead Free: Lead Free; Weight: 0.000194oz; Number of Pins: 2; Package Quantity: 5000; Height: 0.45mm; Composition: Thick Film; Military Standard: Not; Tolerance: 1%; Case Code (Metric): 2012; Termination: SMD/SMT; Mount: Surface Mount; Radiation Hardening: No; Width: 1.25mm; Length: 2mm; Depth: 1.25mm; Packaging: Tape and Reel; Min Operating Temperature: -55°C; Contact Plating: Tin; Temperature Coefficient: 100ppm/°C; Voltage Rating (DC): 150V
R294 = CMP-2002-01154-4: Chip Resistor, 4.7 KOhm, +/- 1%, 0.1 W, -55 to 155 degC, 0402 (1005 Metric), RoHS, Tape and Reel; PartNumber: ERJ-2RKF4701X; Voltage Rating: 50 V; Case\/Package: 0402; Power Rating: 100 mW; Height: 0.35 mm; Mounting Technology: Surface Mount; REACH SVHC: Yes; Resistance: 4.7 KOhm; Max Operating Temperature: 155 degC; ComponentLink1Description: Manufacturer URL; ComponentLink2Description: Datasheet; Pins: 2; PackageReference: 0402; Tolerance: 1%; Case Code (Imperial): 0402; Length: 1 mm; PackageDescription: 2-Pin Surface Mount Device, Body 1 x 0.5 mm; RoHSCompliant: true; Package Quantity: 1; Radiation Hardening: No; DatasheetVersion: 04/2015; Width: 0.5 mm; Case Code (Metric): 1005; Mount: Surface Mount; ComponentLink1URL: http://www.panasonic.com/; Min Operating Temperature: -55 degC; Packaging: Cut Tape; ComponentLink2URL: http://industrial.panasonic.com/cdbs/www-data/pdf/RDA0000/AOA0000C86.pdf
R295 R296 R300-R302 = CMP-2002-08143-1: Part Number: CRCW040210R0FKED; Manufacturer: Vishay Dale
R297 = CMP-26527-000005-1: RES 0.001 OHM 1% 5W 3920; Manufacturer Part Number: HCS3920FT1L00; Manufacturer: Stackpole Electronics; Automotive Grade: Grade 0; Temperature Coefficient: 50ppm/°C; Value: 1mΩ; Standoff Height: 0.4mm; Temperature Range High: +170°C; ComponentLink2URL: https://www.seielect.com/catalog/sei-hcs.pdf; Temperature Range Low: -55°C; Octopart: https://octopart.com/hcs3920ft1l00-stackpole+electronics-33343675; Lead Free: Yes; Power Rating: 5W; Category: Res; Package: 0; Tolerance: 1%; Composition: Metal Element; Height: 1.07mm; Resistance: 1mΩ; Digikey Description: RES 0.001 OHM 1% 5W 3920; Device Class L1: Passive Components; Series: HCS; Automotive: Yes; Device Class L3: Chip SMD Resistors; RoHS: TRUE; ComponentLink2Description: Datasheet; Device Class L2: Resistors; Temperature: -55°C to +170°C
R299 = CMP-2002-01102-1: Part Number: ERJ-2RKF90R9X; Manufacturer: Panasonic
R303 = CMP-2002-08197-1: Manufacturer: Vishay Dale; Part Number: CRCW040213K3FKED
R304 = CMP-2001-00128-1: Manufacturer: Panasonic; Part Number: ERJ-6ENF3241V
R305 = CMP-2000-03622-1: Manufacturer: Vishay Dale; Part Number: CRCW06038K25FKEA
R306 = CMP-2002-08167-1: Part Number: CRCW0402120KFKED; Manufacturer: Vishay Dale
R307 = CMP-2002-08171-2: RES Thick Film, 121kΩ, 1%, 0.063W, 100ppm/°C, 0402; Voltage Rating (DC): 50V; Max Power Dissipation: 63mW; Resistance: 121kR; Military Standard: Not; Weight: 2.3E-05oz; Termination: SMD/SMT; Case Code (Metric): 1005; Width: 0.5mm; Tolerance: 1%; Contact Plating: Tin; Temperature Coefficient: 100ppm/°C; Depth: 0.5mm; Length: 1mm; Package Quantity: 10; Radiation Hardening: No; Packaging: Tape and Reel; Power Rating: 63mW; Features: Automotive AEC-Q200; Lead Free: Lead Free; Composition: Thick Film; Min Operating Temperature: -55°C; Height: 0.35mm; Voltage Rating: 50V; Case/Package: 0402; Number of Terminations: 2; Max Operating Temperature: 155°C; Case Code (Imperial): 0402
U6 U7 = CMP-0859-00406-3: Single Buffer/Driver With Open-Drain Output, DCK0005A, SMALL T&R; Manufacturer: Texas Instruments; Input Type: CMOS; F @ Nom Voltage(Max)(Mhz): 250; Rating: Catalog; Bits(#): 1; Schmitt Trigger: No; VCC(Min)(V): 0.8; tpd @ Nom Voltage(Max)(ns): 4.7,3.3,2.4,2.3,1.8; Output Drive (IOL/IOH)(Max)(mA): 9/-9; VCC(Max)(V): 2.7; Technology Family: AUC; ICC @ Nom Voltage(Max)(mA): 0.01; Voltage(Nom)(V): 0.8,1.2,1.5,1.8,2.5; Sub-Family: Non-Inverting Buffer/Driver; Logic: True; DatasheetVersion: SCES373Q; 3-State Output: No; Operating Temperature Range(C): -40 to 85; Generic Part Number: SN74AUC1G07; PackageReference: DCK0005A; Output Type: CMOS